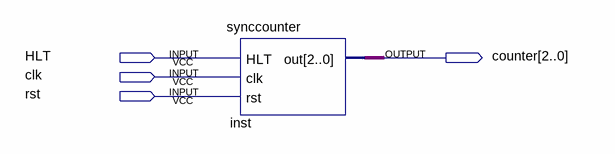
[diagram p0: schematic sheet]
// Quartus schematic teste_contador.bdf as structural Verilog: 1 symbols, 4 pins
module teste_contador (
  input  HLT,
  input  clk,
  input  rst,
  output [2:0] counter
);

  synccounter inst (.HLT(HLT), .clk(clk), .rst(rst), .out(counter));
endmodule
